# EAGLE design balloon-v06 (EAGLE 7.6.0)
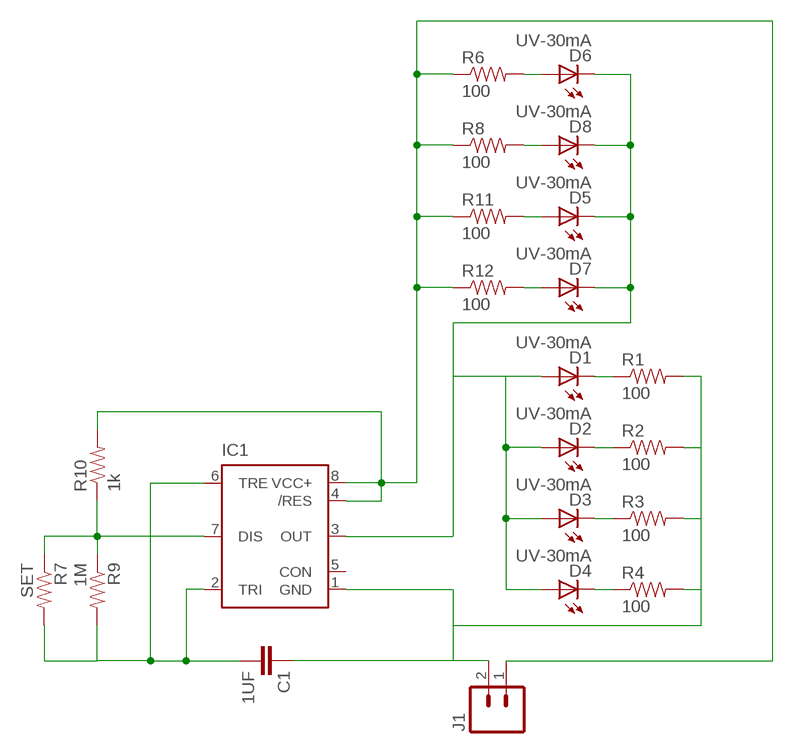
[diagram p0: schematic, sheet 1]

## Parts
C1  1UF  CAP0603-CAP  [0603-CAP]
D1  UV-30mA  LEDCHIPLED_0603  [CHIPLED_0603]
D2  UV-30mA  LEDCHIPLED_0603  [CHIPLED_0603]
D3  UV-30mA  LEDCHIPLED_0603  [CHIPLED_0603]
D4  UV-30mA  LEDCHIPLED_0603  [CHIPLED_0603]
D5  UV-30mA  LEDCHIPLED_0603  [CHIPLED_0603]
D6  UV-30mA  LEDCHIPLED_0603  [CHIPLED_0603]
D7  UV-30mA  LEDCHIPLED_0603  [CHIPLED_0603]
D8  UV-30mA  LEDCHIPLED_0603  [CHIPLED_0603]
IC1  NE555D  [SO08]
J1  M02PTH3  [1X02_LONGPADS]
R1  100  RESISTOR0603-RES  [0603-RES]
R2  100  RESISTOR0603-RES  [0603-RES]
R3  100  RESISTOR0603-RES  [0603-RES]
R4  100  RESISTOR0603-RES  [0603-RES]
R6  100  RESISTOR0603-RES  [0603-RES]
R7  SET  RESISTOR0603  [0603-RES]
R8  100  RESISTOR0603-RES  [0603-RES]
R9  1M  RESISTOR0603-RES  [0603-RES]
R10  1k  RESISTOR0603-RES  [0603-RES]
R11  100  RESISTOR0603-RES  [0603-RES]
R12  100  RESISTOR0603-RES  [0603-RES]

## Nets
DISCHARGE: IC1.7(DIS) R7.1 R9.1 R10.1
GND: C1.1 IC1.1(GND) J1.2 R1.2 R2.2 R3.2 R4.2
N$1: D8.A R8.2
N$2: D5.A R11.2
N$3: D1.C R1.1
N$4: D7.A R12.2
N$5: D2.C R2.1
N$6: D6.A R6.2
N$7: D3.C R3.1
N$9: D4.C R4.1
OUT: D1.A D2.A D3.A D4.A D5.C D6.C D7.C D8.C IC1.3(OUT)
THRESHOLD: C1.2 IC1.2(TRI) IC1.6(TRE) R7.2 R9.2
VCC: IC1.4(/RES) IC1.8(VCC+) J1.1 R6.1 R8.1 R10.2 R11.1 R12.1
Unconnected: IC1.5(CON)

## Library data of the parts
C1 = SparkFun-Capacitors:CAP: Capacitor Standard 0603 ceramic capacitor, and 0.1" leaded capacitor.; DIGIKEY_PART_ID: 1276-1946-1-ND
D1-D8 = led:LED: LED OSRAM: - CHIPLED LG R971, LG N971, LY N971, LG Q971, LY Q971, LO R971, LY R971 LH N974, LH R974 LS Q976, LO Q976, LY Q976 LO Q996 - Hyper CHIPLED LW Q18S LB Q993, LB Q99A, LB R99A - SideLED LS A670, LO A670, LY A670, LG A670, LP A670 LB A673, LV A673, LT A673, LW A673 LH A674 LY A675 LS A676, LA A676, LO A676, LY A676, LW A676 LS A679, LY A679, LG A679 - Hyper Micro SIDELED® LS Y876, LA Y876, LO Y876, LY Y876 LT Y87S - SmartLED LW L88C, LW L88S LB L89C, LB L89S, LG L890 LS L89K, LO L89K, LY L89K LS L896, LA L896, LO L896, LY L896 - TOPLED LS T670, LO T670, LY T670, LG T670, LP T670 LSG T670, LSP T670, LSY T670, LOP T670, LYG T670 LG T671, LOG T671, LSG T671 LB T673, LV T673, LT T673, LW T673 LH T674 LS T676, LA T676, LO T676, LY T676, LB T676, LH T676, LSB T676, LW T676 LB T67C, LV T67C, LT T67C, LS T67K, LO T67K, LY T67K, LW E67C LS E67B, LA E67B, LO E67B, LY E67B, LB E67C, LV E67C, LT E67C LW T67C LS T679, LY T679, LG T679 LS T770, LO T770, LY T770, LG T770, LP T770 LB T773, LV T773, LT T773, LW T773 LH T774 LS E675, LA E675, LY E675, LS T675 LS T776, LA T776, LO T776, LY T776, LB T776 LHGB T686 LT T68C, LB T68C - Hyper Mini TOPLED® LB M676 - Mini TOPLED Santana® LG M470 LS M47K, LO M47K, LY M47K Source: http://www.osram.convergy.de LUXEON: - LUMILED® LXK2-PW12-R00, LXK2-PW12-S00, LXK2-PW14-U00, LXK2-PW14-V00 LXK2-PM12-R00, LXK2-PM12-S00, LXK2-PM14-U00 LXK2-PE12-Q00, LXK2-PE12-R00, LXK2-PE12-S00, LXK2-PE14-T00, LXK2-PE14-U00 LXK2-PB12-K00, LXK2-PB12-L00, LXK2-PB12-M00, LXK2-PB14-N00, LXK2-PB14-P00, LXK2-PB14-Q00 LXK2-PR12-L00, LXK2-PR12-M00, LXK2-PR14-Q00, LXK2-PR14-R00 LXK2-PD12-Q00, LXK2-PD12-R00, LXK2-PD12-S00 LXK2-PH12-R00, LXK2-PH12-S00 LXK2-PL12-P00, LXK2-PL12-Q00, LXK2-PL12-R00 Source: www.luxeon.com KINGBRIGHT: KA-3528ASYC Source: www.kingbright.com
IC1 = SparkFun-AnalogIC:NE555: General purpose bipolar Timer; DIGIKEY_PART_ID: ICM7555CBAZ-TCT-ND
J1 = SparkFun-Connectors:M02: Standard 2-pin 0.1" header. Use with - straight break away headers ( PRT-00116) - right angle break away headers (PRT-00553) - swiss pins (PRT-00743) - machine pins (PRT-00117) - female headers (PRT-00115) Molex polarized connector foot print use with: PRT-08233 with associated crimp pins and housings. 2.54_SCREWTERM for use with PRT-10571. 3.5mm Screw Terminal footprints for PRT-08084 5mm Screw Terminal footprints for use with PRT-08432
R1-R4 R6 R8 R11 R12 = SparkFun-Resistors:RESISTOR: Resistor Basic schematic elements and footprints for 0603, 1206, and PTH resistors.; DIGIKEY_PART_ID: P100BZCT-ND
R7 R9 = SparkFun-Resistors:RESISTOR: Resistor Basic schematic elements and footprints for 0603, 1206, and PTH resistors.; DIGIKEY_PART_ID: P1MBZCT-ND
R10 = SparkFun-Resistors:RESISTOR: Resistor Basic schematic elements and footprints for 0603, 1206, and PTH resistors.; DIGIKEY_PART_ID: P1KBZCT-ND

## Board
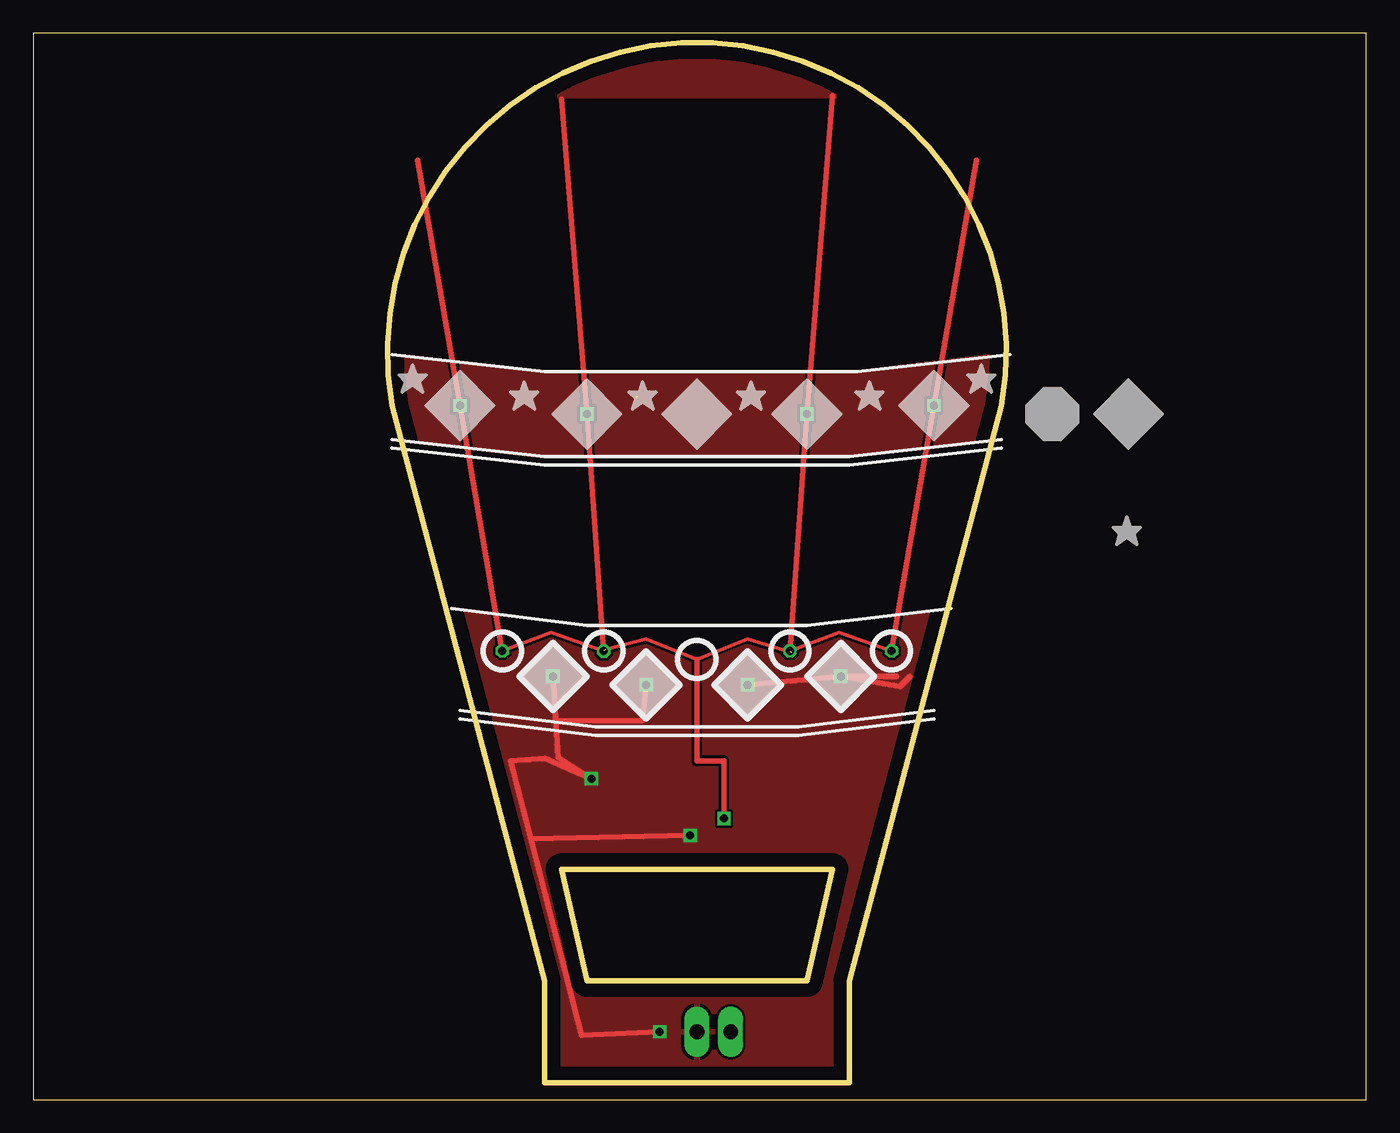
[diagram p1: board, top side]
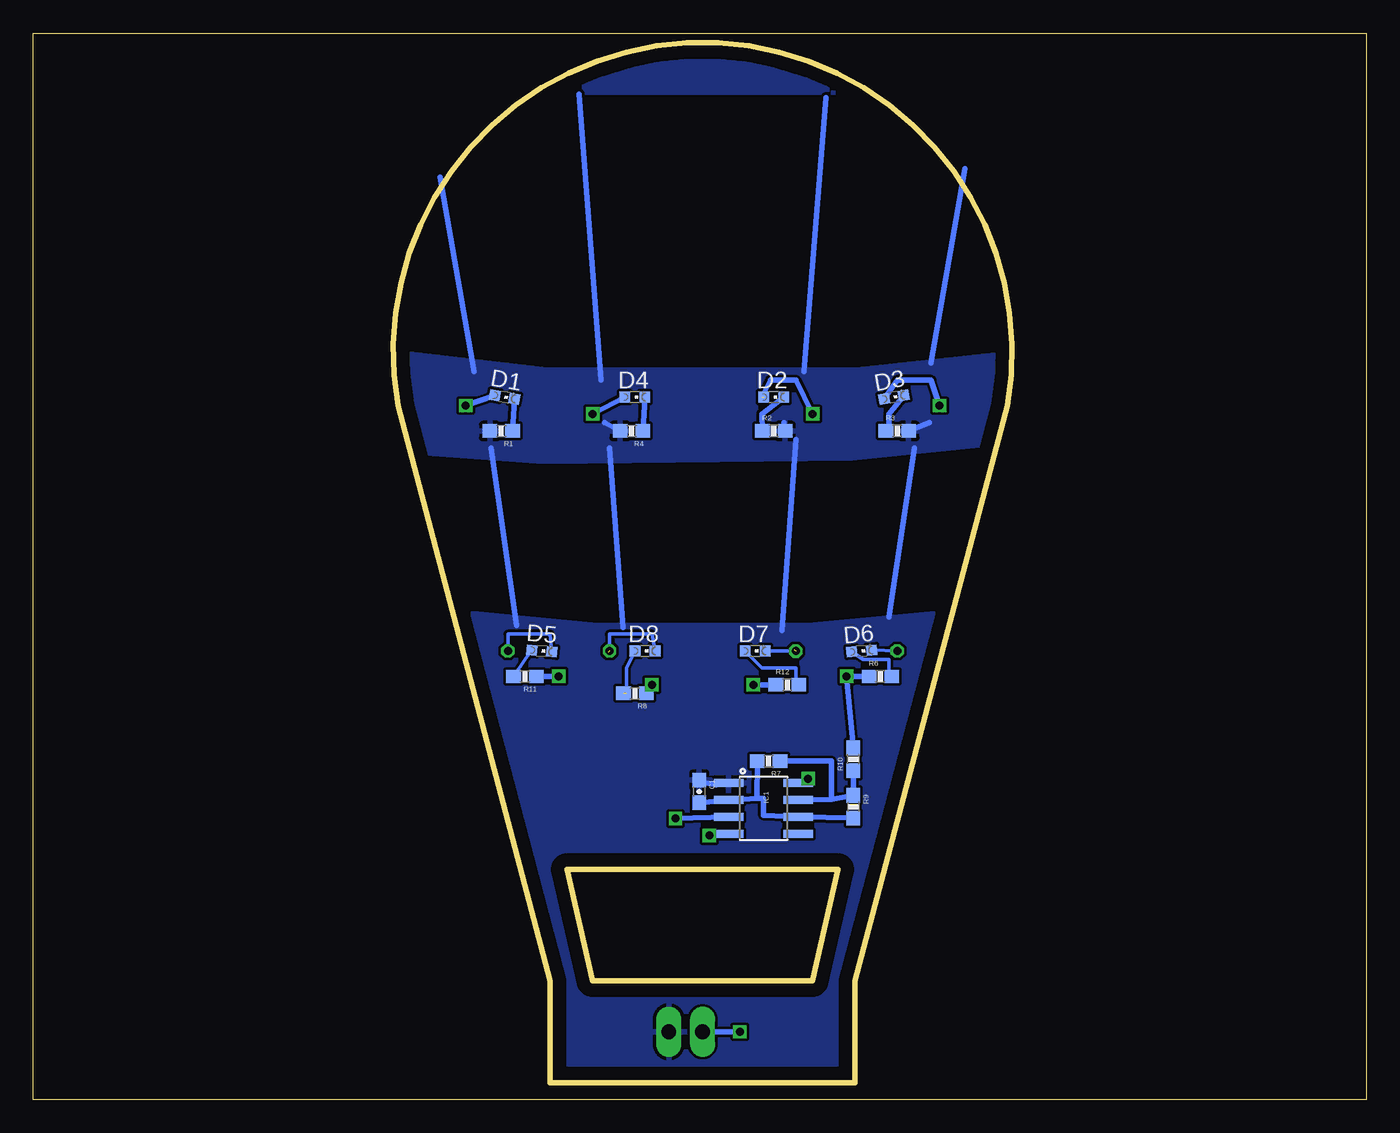
[diagram p2: board, bottom side, seen from below]

Size 100 x 80 mm. Coordinates in mm from the lower left corner, seen from the top.
Outline: 0,0 100,0 100,80 0,80 0,0
Outline: 26.92,52.07 arc-200 72.64,52.07 61.21,8.89 61.21,1.27 38.35,1.27 38.35,8.89 26.92,52.07
Outline: 39.62,17.27 41.53,8.89 58.04,8.89 59.94,17.27 39.62,17.27
Copper layers (1*16): Top 0.035mm / dielectric 1.5mm / Bottom 0.035mm
Design rules "default": minimum track width 10mil, minimum drill 24mil, track to track 8mil, track to pad 8mil, pad to pad 8mil, via to via 8mil, smd to smd 8mil, copper to edge 40mil, drill to drill 8mil, minimum pad ring 10mil, minimum via ring 8mil, stop-mask expansion 4mil, vias tented up to drill 0mil, thermal gap 10mil

### Footprints (pad centres in the part's own frame; a part is rotated, then mirrored left to right if it is on the bottom)
0603-CAP = smd 1.1 x 1: 1 -0.85,0; 2 0.85,0
CHIPLED_0603 = smd 0.8 x 0.8: A 0,-0.75; C 0,0.75
SO08 = smd 0.61 x 2.21: 1 -1.905,-2.616; 2 -0.635,-2.616; 3 0.635,-2.616; 4 1.905,-2.616; 5 1.905,2.616; 6 0.635,2.616; 7 -0.635,2.616; 8 -1.905,2.616
1X02_LONGPADS = drill 1.118 pad 1.88 long: 1 0,0; 2 2.54,0
0603-RES = smd 1.1 x 1: 1 -0.85,0; 2 0.85,0

### Placement (x,y rotation side)
C1  50.04,23.11 270 bottom
D1  64.64,52.7 260 bottom
D2  44.45,52.7 270 bottom
D3  35.43,52.7 280 bottom
D4  54.86,52.7 270 bottom
D5  61.85,33.66 265 bottom
D6  37.85,33.66 275 bottom
D7  45.85,33.66 270 bottom
D8  54.1,33.66 270 bottom
IC1  45.21,21.84 270 bottom
J1  49.78,5.08 0 top
R1  64.9,50.16 180 bottom
R2  44.45,50.16 0 bottom
R3  35.18,50.16 0 bottom
R4  55.12,50.16 180 bottom
R6  36.45,31.75 0 bottom
R7  44.83,25.4 180 bottom
R8  54.86,30.48 180 bottom
R9  38.48,21.97 270 bottom
R10  38.48,25.53 90 bottom
R11  63.12,31.75 180 bottom
R12  43.43,31.11 0 bottom

### Tracks (layer width: path | path; a pad name or v marks a point on that pad's centre or on a via)
BOTTOM
  pour Bottom: 37.08,75.56 62.48,75.56 56.77,79.38 49.15,80.01 40.77,78.23
DISCHARGE
  Bottom 0.406: R10.1 R9.1 40.12,22.53 | IC1.7 40.12,22.53 | R7.1 40.13,25.4 40.12,22.53
GND
  Bottom 0.406: R3.2 32.77,50.8 | R2.2 43.69,50.8 | R4.2 57.15,50.8 | 48.77,23.62 50.04,23.88 | 63.75,35.56 65.66,48.9 | 55.75,35.43 56.77,48.9 | 43.81,35.18 42.8,49.53 | 35.81,36.2 33.91,48.9 | 32.64,55.24 30.1,69.85 | 42.16,54.61 40.51,75.18 | 57.4,53.98 59.05,75.44 | 66.93,54.61 69.47,69.22
  pour Bottom: 26.42,56.01 38.23,54.74 61.47,54.74 74.68,56.26 72.64,48.64 61.72,47.88 38.61,48.13 27.18,49.28 26.42,55.63
  pour Bottom: 29.97,36.7 41.91,35.56 57.66,35.56 69.34,36.7 68.83,34.92 62.48,0.64 37.08,0.64 29.46,34.92
N$1  (1 unrouted)
  Bottom 0.254: 55.5,30.48 55.5,32.38 D8.A
N$2
  Bottom 0.254: R11.2 63.12,33.02 D5.A
N$3
  Bottom 0.406: R1.1 D1.C
N$4
  Bottom 0.254: R12.2 42.8,31.11 42.8,32.38 45.34,32.38 D7.A
N$5
  Bottom 0.406: R2.1 45.34,51.44 D2.C
N$6
  Bottom 0.254: R6.2 35.81,31.75 35.81,33.02 37.72,33.02 D6.A
N$7
  Bottom 0.406: R3.1 35.81,50.16 35.81,51.44 D3.C
N$8
  pour Top: 26.42,55.88 38.35,54.61 61.98,54.61 74.17,56.13 72.64,49.53 61.21,48.26 38.1,48.26 27.18,49.53
N$9
  Bottom 0.406: R4.1 D4.C
OUT  (via drill 0.6)  (4 unrouted)
  Top 0.254: v35.18,33.66 38.86,35.05 v42.8,33.64 | v56.77,33.66 60.45,35.05 v64.39,33.66 | 42.93,33.78 45.97,34.54 49.78,33.02 53.59,34.54 56.9,33.53
  Top 0.406: v42.8,33.64 v41.53,51.44 | v35.18,33.66 v32,52.07 28.83,70.48 | v64.39,33.66 v67.56,52.07 70.74,70.48 | v51.82,21.08 51.81,25.42 49.78,25.4 49.78,33.02 | v56.77,33.66 v58.04,51.44 59.94,75.31 | 41.53,51.42 39.62,75.06
  Bottom 0.254: D6.C v35.18,33.66 | D5.C 61.21,34.92 64.39,34.92 v64.39,33.66 | D8.C 53.59,34.92 56.77,34.92 v56.77,33.66 | D7.C v42.8,33.64
  Bottom 0.406: IC1.3 v51.82,21.08 | v67.56,52.07 D1.A | D4.A v58.04,51.44 | 45.34,52.7 44.7,53.98 42.8,53.98 v41.53,51.44 | v32,52.07 32.64,53.98 35.18,53.98 D3.A
  pour Top: 37.34,75.31 62.74,75.31 57.02,79.12 49.4,79.76 41.78,78.49
THRESHOLD
  Bottom 0.406: 45.44,22.59 45.21,22.61 45.21,21.34 IC1.6 R9.2 | 45.44,22.59 IC1.2 C1.2 | 45.44,22.59 45.72,22.61 R7.2
VCC  (via drill 0.6)
  Top 0.406: v46.99,5.08 41.15,4.83 37.46,19.08 | 37.46,19.08 37.34,19.56 v49.28,19.81 | 37.46,19.08 35.81,25.4 38.4,25.58 v41.88,24.07 39.37,25.65 v38.99,31.75 | v45.97,31.11 45.72,28.45 39.5,28.41 | v53.59,31.11 v60.58,31.75 | v60.58,31.75 64.77,31.75 | v60.58,31.75 65.02,30.99 65.79,31.75
  Bottom 0.406: J1.1 v46.99,5.08 | v49.28,19.81 IC1.4 | R12.1 v45.97,31.11 | IC1.8 v41.88,24.07 | R6.1 v38.99,31.75 R10.2 | R8.1 v53.59,31.11 | R11.1 v60.58,31.75
  pour Top: 29.46,36.83 42.16,35.56 55.88,35.31 70.1,36.83 65.02,-2.54 29.46,0